# Altium project 7.09寸6色墨水屏.PrjPcb
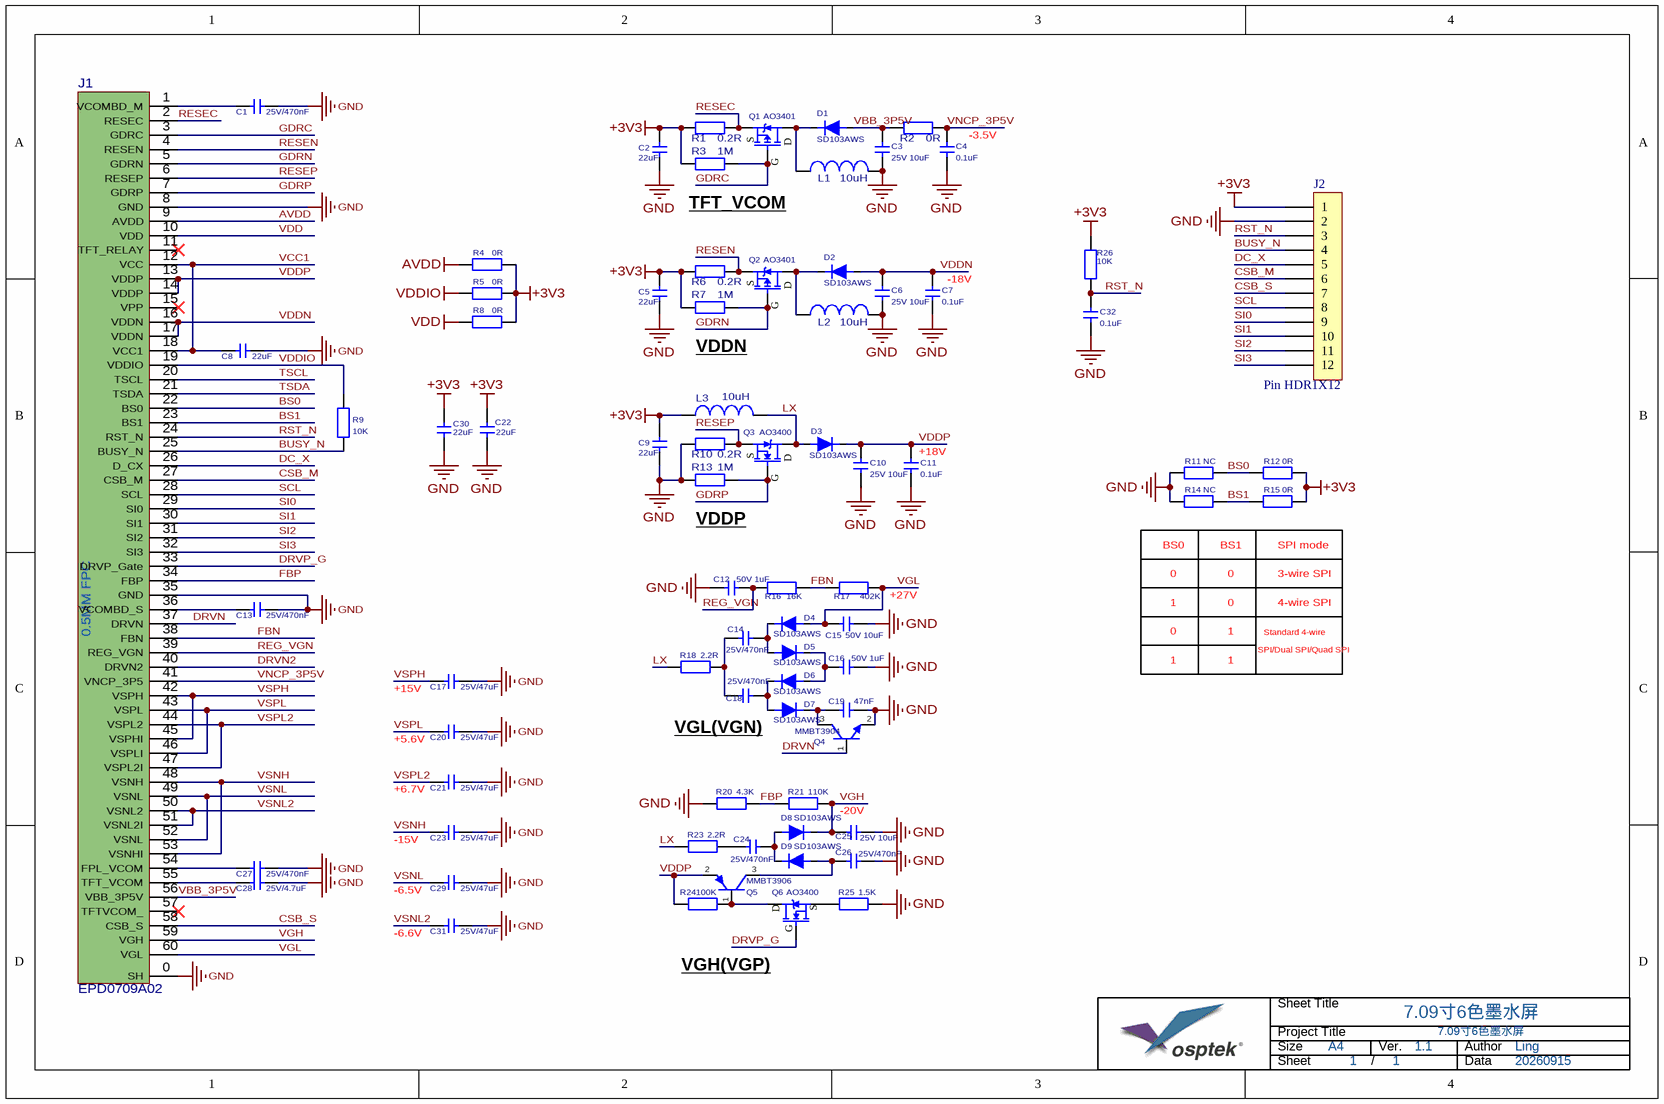
[diagram p0: 7.09寸6色墨水屏.SchDoc]
1 sheet, 76 parts. Net scope: global (net labels, ports and power ports of the same name join across sheets).
Board file: 7.09寸6色墨水屏.PcbDoc

## Sheet 7.09寸6色墨水屏.SchDoc
size A4; Author: Ling; SheetNumber: 1; SheetTotal: 1; uSheetSize: A4; uProjectTitle: 7.09寸6色墨水屏; uSheetTitle: 7.09寸6色墨水屏; uData: 20260915; uVersion: 1.1; SPICEModelCacheCYWRDDRR: <root> / <DocumentId>CYWRDDRR</DocumentId> / <CacheFrame Number="0"> / <Model Name="npn" Kind="MDL"> / <Text>*Default NPN BJT / *NPN Trans Pinout: C,B,E / .MODEL NPN NPN()</Text> / </Model> / </CacheFrame> / </root>

### Parts
C1  25V/470nF  [0603-C]
C2  22uF  [0603-C]
C3  25V 10uF  [0805-C]
C4  0.1uF  [0603-C]
C5  22uF  [0603-C]
C6  25V 10uF  [0805-C]
C7  0.1uF  [0603-C]
C8  22uF  [0603-C]
C9  22uF  [0603-C]
C10  25V 10uF  [0805-C]
C11  0.1uF  [0603-C]
C12  50V 1uF  [0603-C]
C13  25V/470nF  [0603-C]
C14  25V/470nF  [0603-C]
C15  50V 10uF  [0805-C]
C16  50V 1uF  [0603-C]
C17  25V/47uF  [1206/3216 C3]
C18  25V/470nF  [0603-C]
C19  47nF  [0603-C]
C20  25V/47uF  [1206/3216 C3]
C21  25V/47uF  [1206/3216 C3]
C22  22uF  [0603-C]
C23  25V/47uF  [1206/3216 C3]
C24  25V/470nF  [0603-C]
C25  25V 10uF  [0805-C]
C26  25V/470nF  [0603-C]
C27  25V/470nF  [0603-C]
C28  25V/4.7uF  [0603-C]
C29  25V/47uF  [1206/3216 C3]
C30  22uF  [0603-C]
C31  25V/47uF  [1206/3216 C3]
C32  0.1uF  [0603-C]
D1  SD103AWS  [SOD-323]
D2  SD103AWS  [SOD-323]
D3  SD103AWS  [SOD-323]
D4  SD103AWS  [SOD-323]
D5  SD103AWS  [SOD-323]
D6  SD103AWS  [SOD-323]
D7  SD103AWS  [SOD-323]
D8  SD103AWS  [SOD-323]
D9  SD103AWS  [SOD-323]
J1  EPD0709A02  [FPC0.5-60P]
J2  Pin HDR1X12  [Pin HDR1X12/2.54mm-S]
L1  10uH  [IND_CB2518_MM]
L2  10uH  [IND_CB2518_MM]
L3  10uH  [IND_CB2518_MM]
Q1  AO3401  [SOT-23-3]
Q2  AO3401  [SOT-23-3]
Q3  AO3400  [SOT-23-3]
Q4  MMBT3904  [SOT-23-3]
Q5  MMBT3906  [SOT-23-3]
Q6  AO3400  [SOT-23-3]
R1  0.2R  [0603-R]
R2  0R  [0603-R]
R3  1M  [0603-R]
R4  0R  [0603-R]
R5  0R  [0603-R]
R6  0.2R  [0603-R]
R7  1M  [0603-R]
R8  0R  [0603-R]
R9  10K  [0603-R]
R10  0.2R  [0603-R]
R11  NC  [0603-R]
R12  0R  [0603-R]
R13  1M  [0603-R]
R14  NC  [0603-R]
R15  0R  [0603-R]
R16  16K  [0603-R]
R17  402K  [0603-R]
R18  2.2R  [0603-R]
R20  4.3K  [0603-R]
R21  110K  [0603-R]
R23  2.2R  [0603-R]
R24  100K  [0603-R]
R25  1.5K  [0603-R]
R26  10K  [0603-R]

### Nets
+3V3: C2.2 C5.2 C9.2 C22.2 C30.1 J2.1 L3.2 R1.2 R3.2 R4.2 R5.2 R6.2 R7.2 R8.2 R12.2 R15.2 R26.2
AVDD: J1.9(AVDD) R4.1
GND: C1.2 C2.1 C3.1 C4.1 C5.1 C6.1 C7.1 C8.2 C9.1 C10.1 C11.1 C12.2 C13.2 C15.1 C16.1 C17.2 C19.1 C20.2 C21.2 C22.1 C23.2 C25.1 C26.1 C27.2 C28.2 C29.2 C30.2 C31.2 C32.1 J1.0(SH) J1.8(GND) J1.35(GND) J2.2 L1.1 L2.1 Q4.2(E) R10.2 R11.1 R13.2 R14.1 R20.2 R25.1
VDD: J1.10(VDD) R8.1
VDDIO: J1.19(VDDIO) R5.1 R9.1
BS0: J1.22(BS0) R11.2 R12.1
BS1: J1.23(BS1) R14.2 R15.1
BUSY_N: J1.25(BUSY_N) J2.4 R9.2
CSB_M: J1.27(CSB_M) J2.6
CSB_S: J1.58(CSB_S) J2.7
DC_X: J1.26(D_CX) J2.5
DRVN: J1.37(DRVN) Q4.1(B)
DRVN2: J1.40(DRVN2)
DRVP_G: J1.33(DRVP_Gate) Q6.1(G)
FBN: J1.38(FBN) R16.1 R17.2
FBP: J1.34(FBP) R20.1 R21.2
GDRC: J1.3(GDRC) Q1.1(G) R3.1
GDRN: J1.5(GDRN) Q2.1(G) R7.1
GDRP: J1.7(GDRP) Q3.1(G) R13.1
LX: D3.A L3.1 Q3.3(D) R18.2 R23.2
REG_VGN: C12.1 J1.39(REG_VGN) R16.2
RESEC: J1.2(RESEC) Q1.2(S) R1.1
RESEN: J1.4(RESEN) Q2.2(S) R6.1
RESEP: J1.6(RESEP) Q3.2(S) R10.1
RST_N: C32.2 J1.24(RST_N) J2.3 R26.1
SCL: J1.28(SCL) J2.8
SI0: J1.29(SI0) J2.9
SI1: J1.30(SI1) J2.10
SI2: J1.31(SI2) J2.11
SI3: J1.32(SI3) J2.12
TSCL: J1.20(TSCL)
TSDA: J1.21(TSDA)
VBB_3P5V: C3.2 D1.A J1.56(VBB_3P5V) R2.2
VCC1: C8.1 J1.12(VCC) J1.18(VCC1)
VDDN: C6.2 C7.2 D2.A J1.16(VDDN) J1.17(VDDN)
VDDP: C10.2 C11.2 D3.K J1.13(VDDP) J1.14(VDDP) Q5.2(E) R24.2
VGH: C25.2 D8.K J1.59(VGH) R21.1
VGL: C15.2 D4.A J1.60(VGL) R17.1
VNCP_3P5V: C4.2 J1.41(VNCP_3P5) R2.1
VSNH: C23.1 J1.48(VSNH) J1.53(VSNHI)
VSNL: C29.1 J1.49(VSNL) J1.52(VSNL)
VSNL2: C31.1 J1.50(VSNL2) J1.51(VSNL2I)
VSPH: C17.1 J1.42(VSPH) J1.45(VSPHI)
VSPL: C20.1 J1.43(VSPL) J1.46(VSPLI)
VSPL2: C21.1 J1.44(VSPL2) J1.47(VSPL2I)
NetC1_1: C1.1 J1.1(VCOMBD_M)
NetC13_1: C13.1 J1.36(VCOMBD_S)
NetC14_1: C14.1 D4.K D5.A
NetC14_2: C14.2 C18.2 R18.1
NetC16_2: C16.2 D5.K D6.A
NetC18_1: C18.1 D6.K D7.A
NetC19_2: C19.2 D7.K Q4.3(C)
NetC24_1: C24.1 D8.A D9.K
NetC24_2: C24.2 R23.1
NetC26_2: C26.2 D9.A Q5.3(C)
NetC27_1: C27.1 J1.54(FPL_VCOM)
NetC28_1: C28.1 J1.55(TFT_VCOM)
NetD1_K: D1.K L1.2 Q1.3(D)
NetD2_K: D2.K L2.2 Q2.3(D)
NetQ5_1: Q5.1(B) Q6.3(D) R24.1
NetQ6_2: Q6.2(S) R25.2

Not connected (* = marked no-connect by the designer): J1 11(TFT_RELAY)* 15(VPP)* 57(TFTVCOM_)*

### Notes on the sheet
- -3.5V
- TFT_VCOM
- (near C7) -18V
- VDDN
- (near C11) +18V
- VDDP
- (near R14) BS0
- BS1
- (near R15) SPI mode
- (near R17) +27V
- 0
- 1
- 3-wire SPI
- 4-wire SPI
- +15V
- SPI/Dual SPI/Quad SPI
- Standard 4-wire
- (near C20) +5.6V
- VGL(VGN)
- (near C21) +6.7V
- -15V
- -20V
- -6.5V
- (near C31) -6.6V
- VGH(VGP)
- Sheet Title
- Project Title
- Size
- Ver.
- Author
- Sheet
- /
- Data
- (in symbol EPD0709A02) 0.5MM FPC

### Library data of the parts
C1-C32 = CAP: Capacitor
D1-D9 = DSK110: pin to pad: A>1 K>2
L1-L3 = INDUCTOR
Q1 Q2 = AO3401: P沟道 30V/4.2A
Q3 Q6 = AO3400: N沟道 30V/4.2A
Q4 = NPN: NPN Bipolar Transistor; Published: 8-Jun-2000; LatestRevisionDate: 17-Jul-2002; LatestRevisionNote: Re-released for DXP Platform.; PackageReference: TO-226-AA; Publisher: Altium Limited; PackageDescription: TO, Flat Index; 3 In-Line, Axial Leads; Body Dia. 4.8mm; Leads 0.55 x 0.51 mm (max); Code_JEDEC: TO-226-AA
Q5 = PNP: NPN Bipolar Transistor; Published: 8-Jun-2000; LatestRevisionDate: 17-Jul-2002; LatestRevisionNote: Re-released for DXP Platform.; PackageReference: TO-226-AA; Publisher: Altium Limited; PackageDescription: TO, Flat Index; 3 In-Line, Axial Leads; Body Dia. 4.8mm; Leads 0.55 x 0.51 mm (max); Code_JEDEC: TO-226-AA
R1-R18 R20 R21 R23-R26 = Res2: Resistor; Published: *; LatestRevisionDate: *; LatestRevisionNote: *; PackageReference: *; Publisher: *; Value: *